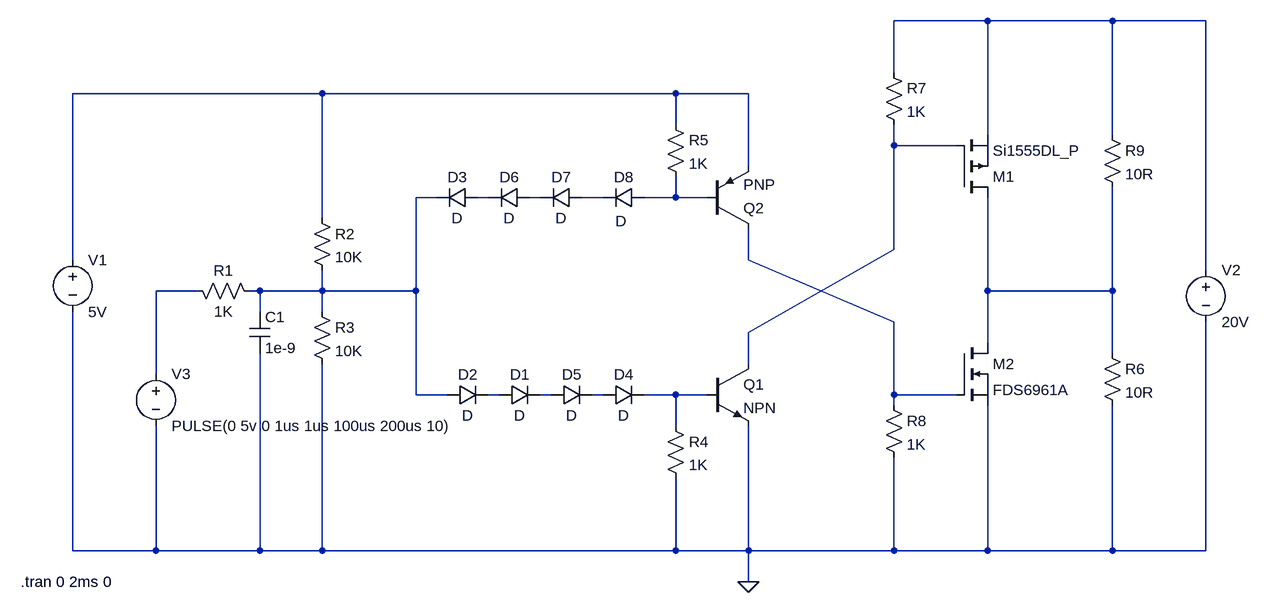
[diagram p0: schematic half-bridge.asc]
half-bridge.asc, the LTspice schematic file:
Version 4
SHEET 1 1980 992
WIRE 1408 -240 1264 -240
WIRE 1600 -240 1408 -240
WIRE 1744 -240 1600 -240
WIRE 1264 -160 1264 -240
WIRE 384 -128 0 -128
WIRE 928 -128 384 -128
WIRE 1040 -128 928 -128
WIRE 928 -80 928 -128
WIRE 1408 -64 1408 -240
WIRE 1600 -64 1600 -240
WIRE 1264 -48 1264 -80
WIRE 1360 -48 1264 -48
WIRE 1040 -16 1040 -128
WIRE 560 32 528 32
WIRE 640 32 624 32
WIRE 720 32 704 32
WIRE 816 32 784 32
WIRE 928 32 928 0
WIRE 928 32 880 32
WIRE 976 32 928 32
WIRE 384 64 384 -128
WIRE 1264 112 1264 -48
WIRE 0 128 0 -128
WIRE 1040 128 1040 80
WIRE 1744 144 1744 -240
WIRE 192 176 128 176
WIRE 288 176 272 176
WIRE 384 176 384 144
WIRE 384 176 288 176
WIRE 528 176 528 32
WIRE 528 176 384 176
WIRE 1408 176 1408 32
WIRE 1600 176 1600 16
WIRE 1600 176 1408 176
WIRE 288 208 288 176
WIRE 384 208 384 176
WIRE 1264 224 1040 128
WIRE 1040 240 1264 112
WIRE 1408 256 1408 176
WIRE 1600 272 1600 176
WIRE 1040 288 1040 240
WIRE 128 304 128 176
WIRE 528 336 528 176
WIRE 576 336 528 336
WIRE 656 336 640 336
WIRE 736 336 720 336
WIRE 816 336 800 336
WIRE 928 336 880 336
WIRE 976 336 928 336
WIRE 1264 336 1264 224
WIRE 1360 336 1264 336
WIRE 1264 352 1264 336
WIRE 928 384 928 336
WIRE 0 576 0 208
WIRE 128 576 128 384
WIRE 128 576 0 576
WIRE 288 576 288 272
WIRE 288 576 128 576
WIRE 384 576 384 288
WIRE 384 576 288 576
WIRE 928 576 928 464
WIRE 928 576 384 576
WIRE 1040 576 1040 384
WIRE 1040 576 928 576
WIRE 1264 576 1264 432
WIRE 1264 576 1040 576
WIRE 1408 576 1408 352
WIRE 1408 576 1264 576
WIRE 1600 576 1600 352
WIRE 1600 576 1408 576
WIRE 1744 576 1744 224
WIRE 1744 576 1600 576
WIRE 1040 624 1040 576
FLAG 1040 624 0
SYMBOL res 288 192 M270
WINDOW 0 32 56 VTop 2
WINDOW 3 0 56 VBottom 2
SYMATTR InstName R1
SYMATTR Value 1K
SYMBOL res 368 48 R0
SYMATTR InstName R2
SYMATTR Value 10K
SYMBOL res 368 192 R0
SYMATTR InstName R3
SYMATTR Value 10K
SYMBOL res 912 368 R0
SYMATTR InstName R4
SYMATTR Value 1K
SYMBOL res 912 -96 R0
SYMATTR InstName R5
SYMATTR Value 1K
SYMBOL res 1248 -176 R0
SYMATTR InstName R7
SYMATTR Value 1K
SYMBOL res 1248 336 R0
SYMATTR InstName R8
SYMATTR Value 1K
SYMBOL cap 272 208 R0
SYMATTR InstName C1
SYMATTR Value 1e-9
SYMBOL npn 976 288 R0
SYMATTR InstName Q1
SYMBOL pnp 976 80 M180
SYMATTR InstName Q2
SYMBOL voltage 0 112 R0
WINDOW 123 0 0 Left 2
WINDOW 39 0 0 Left 2
SYMATTR InstName V1
SYMATTR Value 5V
SYMBOL voltage 1744 128 R0
WINDOW 123 0 0 Left 2
WINDOW 39 0 0 Left 2
SYMATTR InstName V2
SYMATTR Value 20V
SYMBOL pmos 1360 32 M180
SYMATTR InstName M1
SYMATTR Value Si1555DL_P
SYMBOL nmos 1360 256 R0
SYMATTR InstName M2
SYMATTR Value FDS6961A
SYMBOL voltage 128 288 R0
WINDOW 123 0 0 Left 2
WINDOW 39 0 0 Left 2
SYMATTR InstName V3
SYMATTR Value PULSE(0 5v 0 1us 1us 100us 200us 10)
SYMBOL diode 624 16 R90
WINDOW 0 0 32 VBottom 2
WINDOW 3 32 32 VTop 2
SYMATTR InstName D3
SYMBOL diode 816 352 R270
WINDOW 0 32 32 VTop 2
WINDOW 3 0 32 VBottom 2
SYMATTR InstName D4
SYMBOL diode 736 352 R270
WINDOW 0 32 32 VTop 2
WINDOW 3 0 32 VBottom 2
SYMATTR InstName D5
SYMBOL diode 704 16 R90
WINDOW 0 0 32 VBottom 2
WINDOW 3 32 32 VTop 2
SYMATTR InstName D6
SYMBOL diode 784 16 R90
WINDOW 0 0 32 VBottom 2
WINDOW 3 32 32 VTop 2
SYMATTR InstName D7
SYMBOL diode 880 16 R90
WINDOW 0 0 32 VBottom 2
WINDOW 3 37 36 VTop 2
SYMATTR InstName D8
SYMBOL diode 656 352 R270
WINDOW 0 32 32 VTop 2
WINDOW 3 0 32 VBottom 2
SYMATTR InstName D1
SYMBOL diode 576 352 R270
WINDOW 0 32 32 VTop 2
WINDOW 3 0 32 VBottom 2
SYMATTR InstName D2
SYMBOL res 1584 256 R0
SYMATTR InstName R6
SYMATTR Value 10R
SYMBOL res 1584 -80 R0
SYMATTR InstName R9
SYMATTR Value 10R
TEXT -80 624 Left 2 !.tran 0 2ms 0

The netlist it stands for:
* half-bridge.asc
R1 N004 N010 1K
R2 N002 N004 10K
R3 N004 0 10K
R4 N015 0 1K
R5 N002 N008 1K
R7 N001 N003 1K
R8 N009 0 1K
C1 N004 0 1e-9
Q1 N003 N015 0 0 NPN
Q2 N009 N008 N002 0 PNP
V1 N002 0 5V
V2 N001 0 20V
M1 N011 N003 N001 N001 Si1555DL_P
M2 N011 N009 0 0 FDS6961A
V3 N010 0 PULSE(0 5v 0 1us 1us 100us 200us 10)
D3 N005 N004 D
D4 N014 N015 D
D5 N013 N014 D
D6 N006 N005 D
D7 N007 N006 D
D8 N008 N007 D
D1 N012 N013 D
D2 N004 N012 D
R6 N011 0 10R
R9 N001 N011 10R
.model D D
.lib standard.dio
.model NPN NPN
.model PNP PNP
.lib standard.bjt
.model NMOS NMOS
.model PMOS PMOS
.lib standard.mos
.tran 0 2ms 0
.backanno
.end